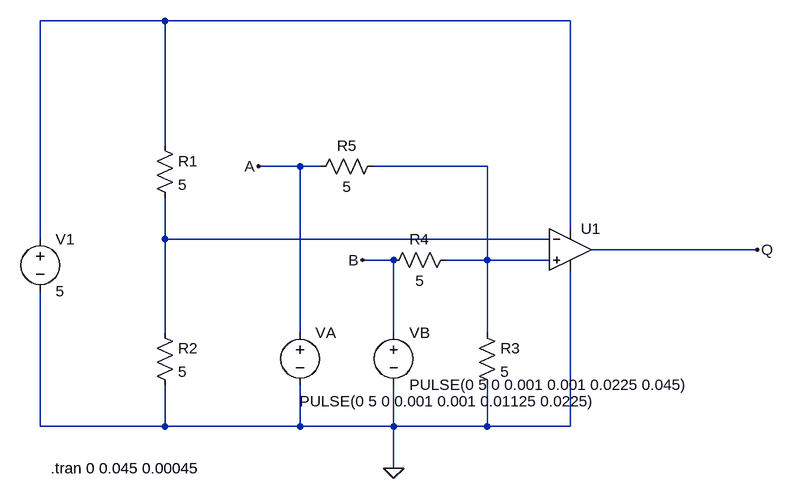
[diagram p0: schematic exercise4.asc]
exercise4.asc, the LTspice schematic file:
Version 4
SHEET 1 880 680
WIRE -560 -224 -752 -224
WIRE 64 -224 -560 -224
WIRE -560 -32 -560 -224
WIRE -352 0 -416 0
WIRE -320 0 -352 0
WIRE -64 0 -240 0
WIRE 64 96 64 -224
WIRE -752 112 -752 -224
WIRE -560 112 -560 48
WIRE 32 112 -560 112
WIRE 352 128 96 128
WIRE -208 144 -256 144
WIRE -64 144 -64 0
WIRE -64 144 -128 144
WIRE 32 144 -64 144
WIRE -560 256 -560 112
WIRE -352 256 -352 0
WIRE -208 256 -208 144
WIRE -64 256 -64 144
WIRE -752 400 -752 192
WIRE -560 400 -560 336
WIRE -560 400 -752 400
WIRE -352 400 -352 336
WIRE -352 400 -560 400
WIRE -208 400 -208 336
WIRE -208 400 -352 400
WIRE -64 400 -64 336
WIRE -64 400 -208 400
WIRE 64 400 64 160
WIRE 64 400 -64 400
WIRE -208 464 -208 400
FLAG -208 464 0
FLAG -416 0 A
FLAG -256 144 B
FLAG 352 128 Q
SYMBOL voltage -752 96 R0
WINDOW 123 0 0 Left 0
WINDOW 39 0 0 Left 0
SYMATTR InstName V1
SYMATTR Value 5
SYMBOL res -576 -48 R0
SYMATTR InstName R1
SYMATTR Value 5
SYMBOL res -576 240 R0
SYMATTR InstName R2
SYMATTR Value 5
SYMBOL res -80 240 R0
SYMATTR InstName R3
SYMATTR Value 5
SYMBOL res -112 128 R90
WINDOW 0 0 56 VBottom 2
WINDOW 3 32 56 VTop 2
SYMATTR InstName R4
SYMATTR Value 5
SYMBOL res -224 -16 R90
WINDOW 0 0 56 VBottom 2
WINDOW 3 32 56 VTop 2
SYMATTR InstName R5
SYMATTR Value 5
SYMBOL voltage -352 240 R0
WINDOW 3 -1 121 Left 2
WINDOW 123 0 0 Left 0
WINDOW 39 0 0 Left 0
SYMATTR InstName VA
SYMATTR Value PULSE(0 5 0 0.001 0.001 0.01125 0.0225)
SYMBOL voltage -208 240 R0
WINDOW 123 0 0 Left 0
WINDOW 39 0 0 Left 0
SYMATTR InstName VB
SYMATTR Value PULSE(0 5 0 0.001 0.001 0.0225 0.045)
SYMBOL OpAmps\\UniversalOpAmp2 64 128 R0
SYMATTR InstName U1
TEXT -736 464 Left 2 !.tran 0 0.045 0.00045

The netlist it stands for:
* exercise4.asc
V1 N001 0 5
R1 N001 N003 5
R2 N003 0 5
R3 N002 0 5
R4 N002 B 5
R5 N002 A 5
VA A 0 PULSE(0 5 0 0.001 0.001 0.01125 0.0225)
VB B 0 PULSE(0 5 0 0.001 0.001 0.0225 0.045)
XU1 N002 N003 N001 0 Q level2 Avol=1Meg GBW=10Meg Slew=10Meg Ilimit=25m Rail=0 Vos=0 En=0 Enk=0 In=0 Ink=0 Rin=500Meg  ; pins In+ In- V+ V- OUT
.tran 0 0.045 0.00045
.lib UniversalOpAmp2.lib
.backanno
.end